# EAGLE design Led_Lamp_V01 (EAGLE 8.2.2)
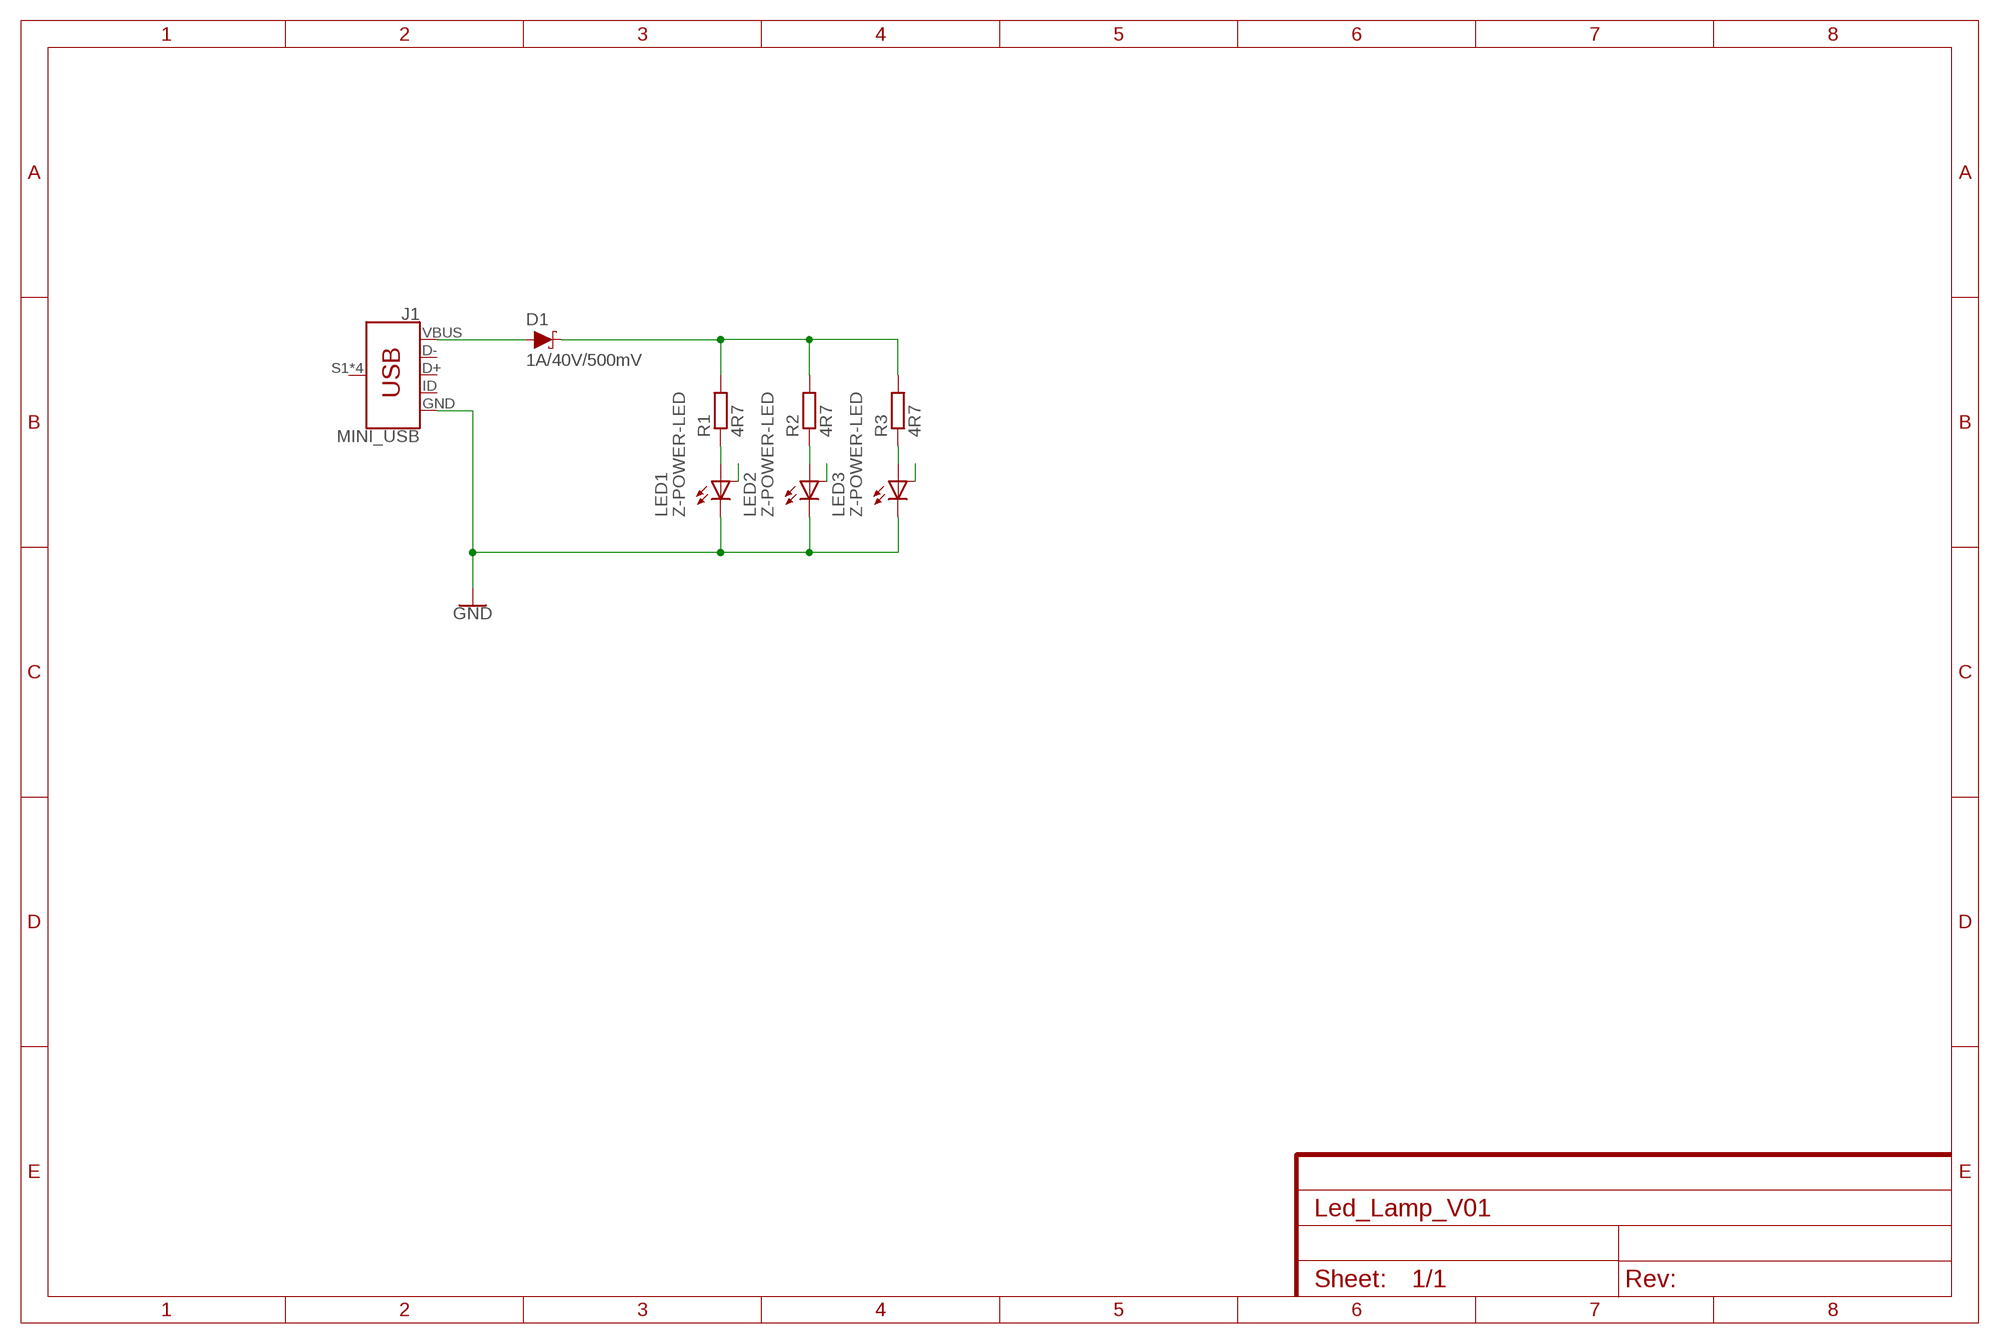
[diagram p0: schematic, sheet 1]

## Parts
D1  1A/40V/500mV  DIODE-SCHOTTKY-SS14  [SMA-DIODE]
J1  MINI_USB  USB_MINI-B_SMT  [USB-MINIB]
LED1  Z-POWER-LED  [Z-POWER-LED-PCB-TYPE]
LED2  Z-POWER-LED  [Z-POWER-LED-PCB-TYPE]
LED3  Z-POWER-LED  [Z-POWER-LED-PCB-TYPE]
R1  4R7  R-EU_R2512  [R2512]
R2  4R7  R-EU_R2512  [R2512]
R3  4R7  R-EU_R2512  [R2512]

## Nets
GND: J1.GND LED1.C LED2.C LED3.C
N$1: D1.A J1.VBUS
N$2: D1.C R1.2 R2.2 R3.2
N$5: LED3.A R3.1
N$6: LED2.A R2.1
N$7: LED1.A R1.1
PAD: LED1.PAD LED2.PAD LED3.PAD
Unconnected: J1.D+ J1.D- J1.ID J1.S1(SHIELD) J1.S2(SHIELD) J1.S3(SHIELD) J1.S4(SHIELD)

## Library data of the parts
D1 = SparkFun-DiscreteSemi:DIODE-SCHOTTKY: Schottky diode A Schottky diode is a semiconductor diode which has a low forward voltage drop and a very fast switching action.; PROD_ID: DIO-08053
J1 = SparkFun-Connectors:USB_MINI-B: USB type Mini-B Connector Breaks out 5th pin, and includes shield pins if needed. SparkFun Products: SparkFun FTDI Basic Breakout <https://www.sparkfun.com/products/9716> SparkFun XBee Explorer USB <https://www.sparkfun.com/products/11812> SparkFun Redboard <https://www.sparkfun.com/products/12757>; PROD_ID: CONN-08193; SF_ID: PRT-00587
LED1-LED3 = led_Power:Z-POWER-LED: Z-Power LED Source: http://www.seoulsemicon.co.kr .. X42182.pdf
R1-R3 = resistor:R-EU_: RESISTOR, European symbol

## Board
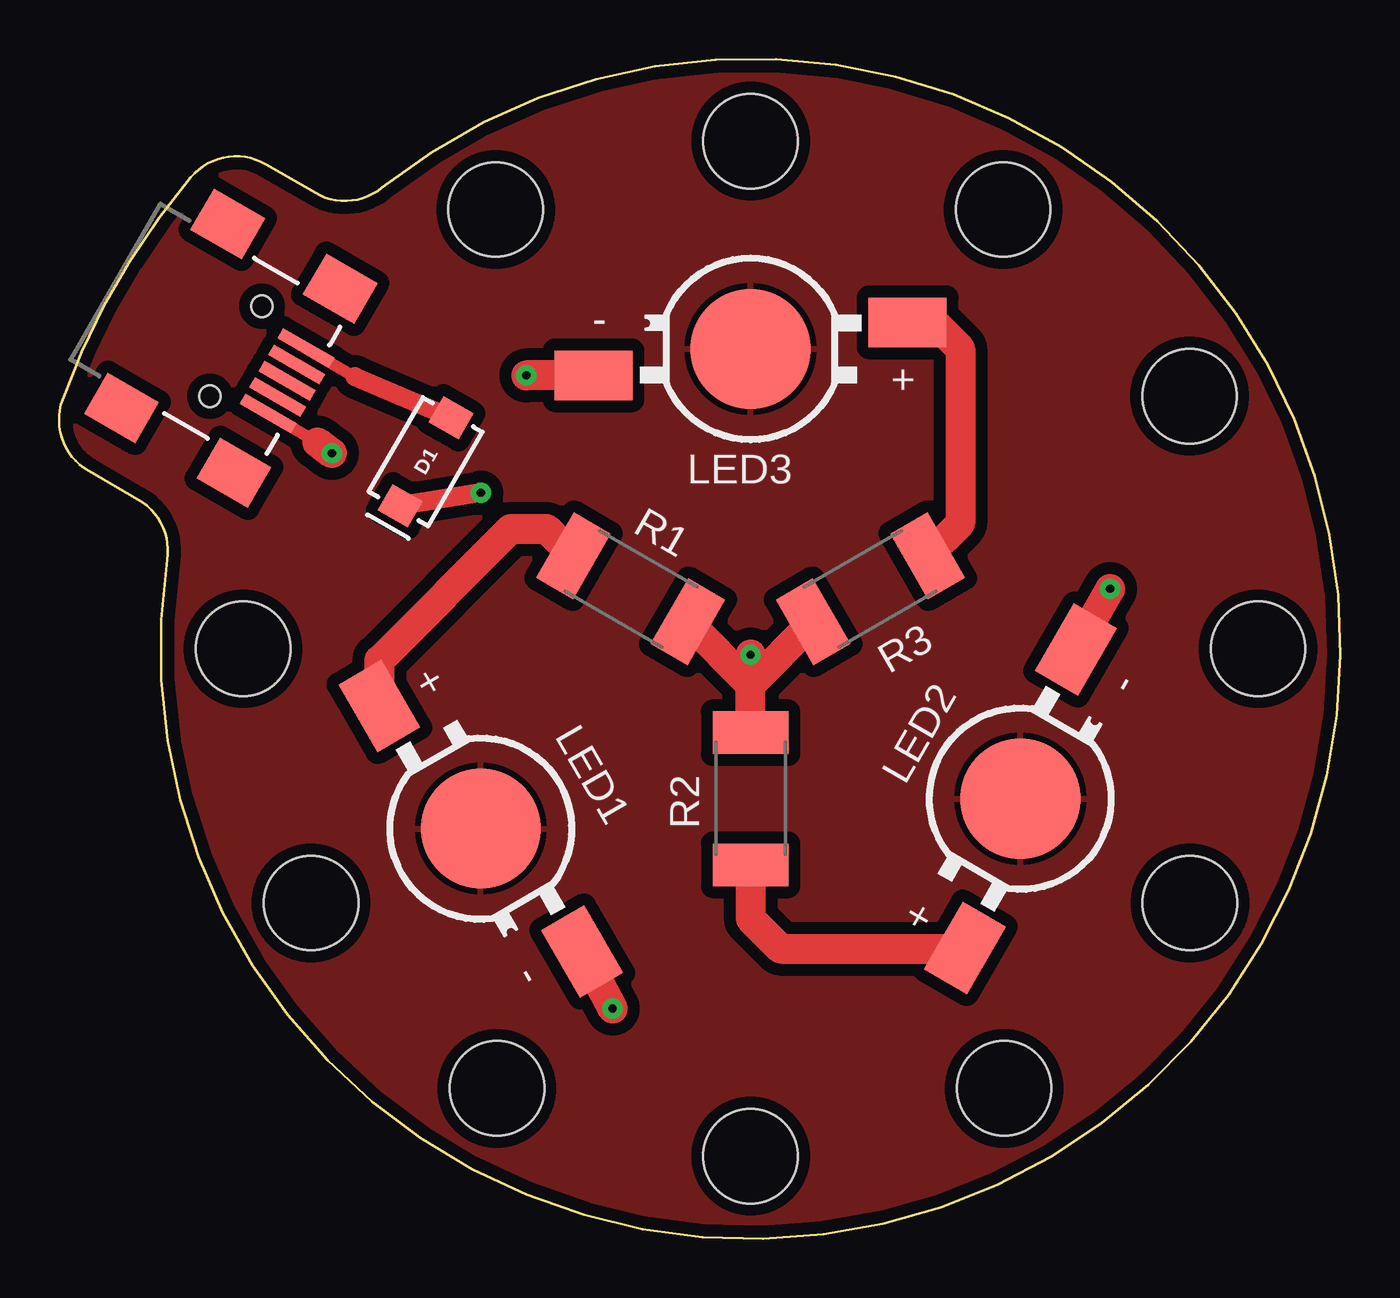
[diagram p1: board, top side]
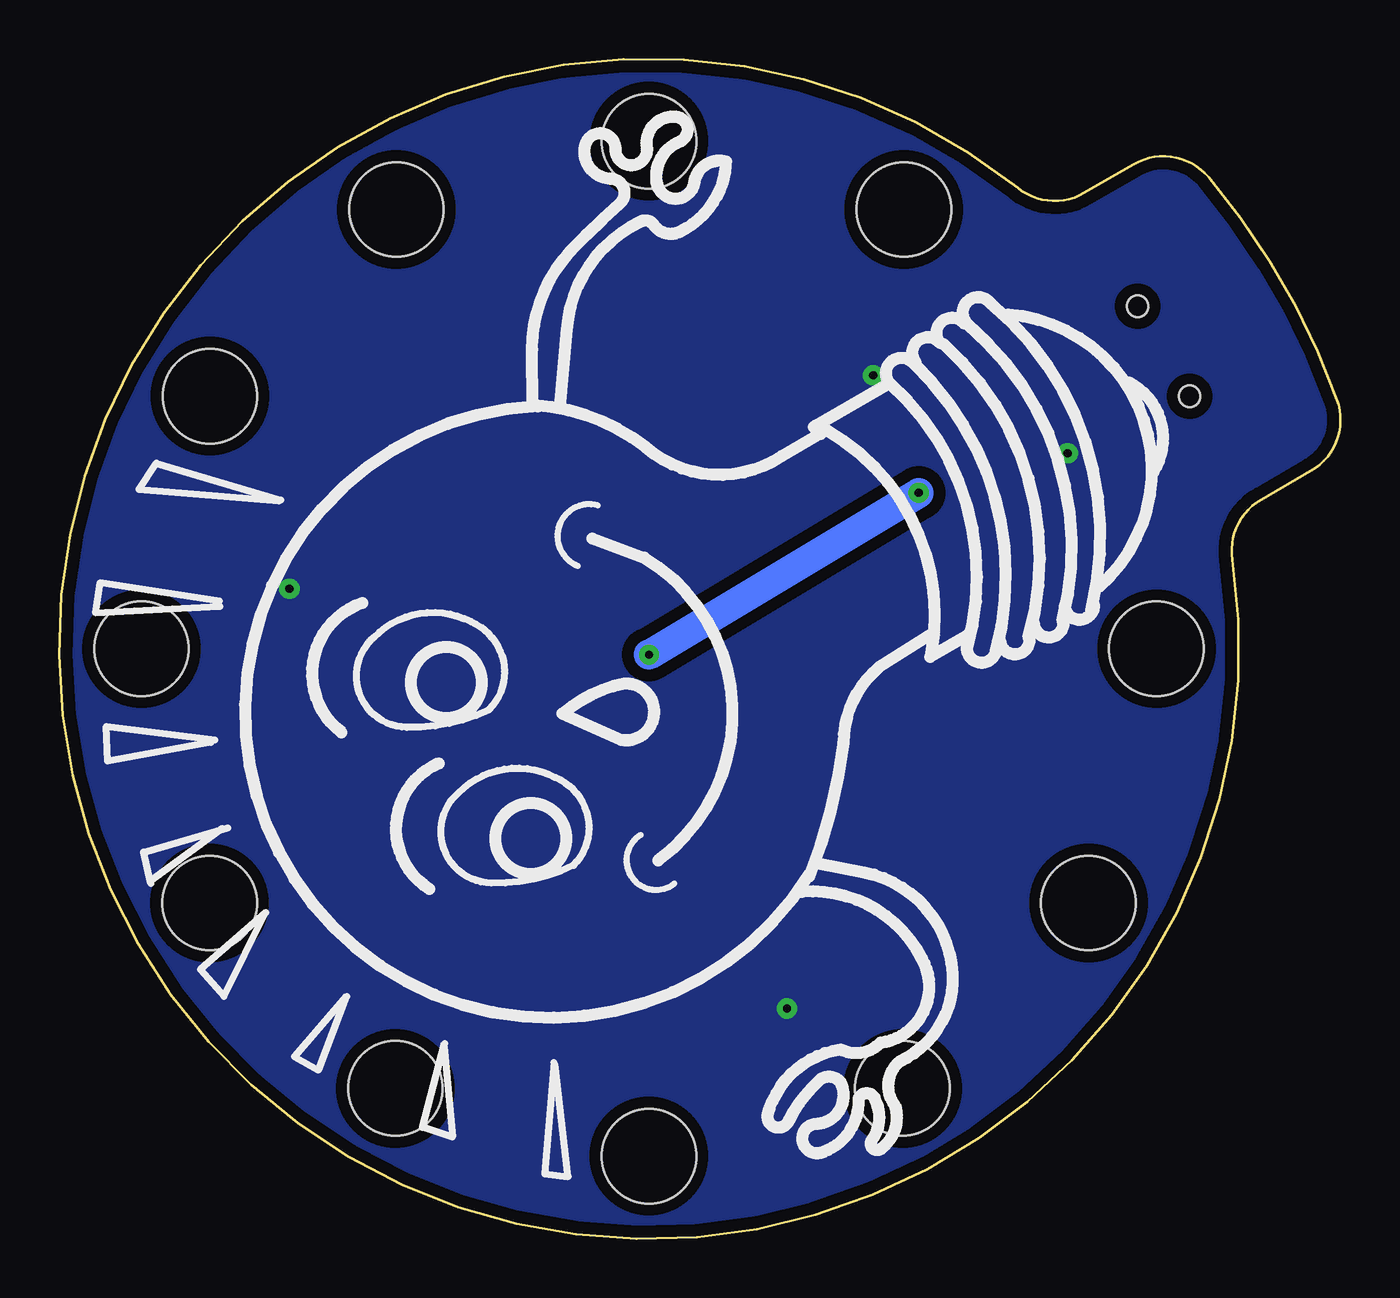
[diagram p2: board, bottom side, seen from below]

Size 54.29 x 49.97 mm. Coordinates in mm from the lower left corner, seen from the top.
Outline: 10.86,44.3 8.75,45.52 arc80 5.59,44.96 arc20 0.15,35.54 arc80 1.25,32.53 3.36,31.31 arc-69 4.58,28.76 arc317 13.68,44.51 arc-69 10.86,44.3
Copper layers (1*16): Top 0.035mm / dielectric 1.5mm / Bottom 0.035mm
Design rules "Modified-SparkFun-2-layer-STANDARD": minimum track width 10mil, minimum drill 10mil, track to track 10mil, track to pad 8mil, pad to pad 8mil, via to via 10mil, smd to smd 8mil, copper to edge 8mil, drill to drill 8mil, minimum pad ring 10mil, minimum via ring 10mil, stop-mask expansion 4mil, vias tented up to drill 25mil, thermal gap 10mil
Holes 4 mm at 7.8,24.99 18.5,43.59 29.3,46.49 40,43.59 47.9,35.69 50.8,24.99 47.92,14.22 40.04,6.37 29.3,3.5 18.55,6.37 10.68,14.22

### Footprints (pad centres in the part's own frame; a part is rotated, then mirrored left to right if it is on the bottom)
SMA-DIODE = smd 1.27 x 1.47: A -2.15,0; C 2.15,0
USB-MINIB = smd 2.5 x 0.5: D+ 2.5,0; D- 2.5,0.8; GND 2.5,-1.6; ID 2.5,-0.8; VBUS 2.5,1.6 | smd 2.5 x 2: S1 -3,4.5; S2 2.5,4.5; S3 -3,-4.5; S4 2.5,-4.5 | hole 0.9: 0,2.2; 0,-2.2
Z-POWER-LED-PCB-TYPE = smd 3.3 x 2.1: A -6.65,-1.12; C 6.65,1.12 | smd 5.08 x 5.08: PAD 0,0
R2512 = smd 1.8 x 3.2: 1 -2.8,0; 2 2.8,0

### Placement (x,y rotation side)
D1  15.53,32.91 240 top
J1  7.5,37.59 330 top
LED1  17.87,17.37 300 top
LED2  40.73,18.64 60 top
LED3  29.3,37.69 180 top
R1  24.22,27.53 330 top
R2  29.3,18.64 90 top
R3  34.38,27.53 210 top

### Tracks (layer width: path | path; a pad name or v marks a point on that pad's centre or on a via)
GND  (via drill 0.35)
  Top 0.508: J1.GND 10.95,33.73
  Top 1.27: LED3.C v19.8,36.57 | LED2.C v44.54,27.53 | LED1.C v23.46,9.75 | 10.95,33.73 v11.56,33.27
  pour Bottom (isolate 0.508): -2.45,-6.76 61.05,-6.76 61.05,56.74 -2.45,56.74
N$1
  Top 0.508: J1.VBUS 12.53,36.52
  Top 0.813: 12.53,36.52 D1.A
N$2  (via drill 0.35)
  Top 0.813: 14.25,31.03 D1.C v17.87,31.6
  Top 1.27: R1.2 29.3,23.48 | R2.2 29.3,23.48 | 29.3,23.48 R3.2 | 29.3,23.48 v29.3,24.74
  Bottom 1.27: v29.3,24.74 v17.87,31.6
N$5
  Top 1.27: LED3.A 37.07,38.81 38.19,37.69 38.19,30.32 R3.1
N$6
  Top 1.27: R2.1 29.3,13.56 30.57,12.29 38.34,12.29 LED2.A
N$7
  Top 1.27: LED1.A 13.57,24.51 19.14,30.07 20.65,30.07 R1.1
PAD
  pour Top (isolate 0.508): -2.45,-6.76 61.05,-6.76 61.05,56.74 -2.45,56.74